# Altium project WaterLevelRF.PrjPcb
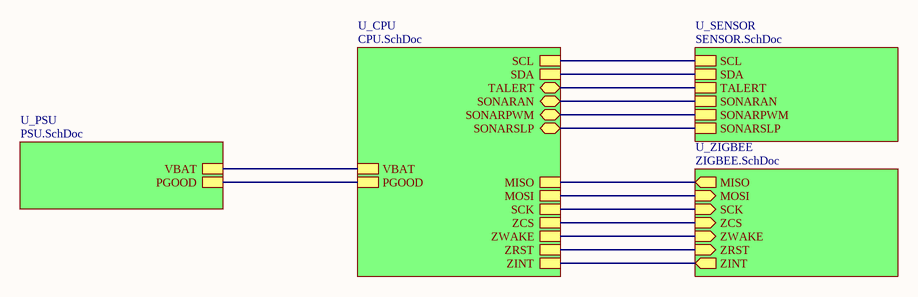
[diagram p0: WaterLevelRF.SchDoc]
7 sheets, 34 parts. Net scope: hierarchical (ports join the sheet entries above them; power ports are global).
Board file: WaterLevelRF.PcbDoc
Sheets:
  WaterLevelRF.SchDoc
    U_SENSOR = SENSOR.SchDoc
      U_TEMP = TEMP.SchDoc
      U_SONAR = SONAR.SchDoc
    U_ZIGBEE = ZIGBEE.SchDoc
    U_CPU = CPU.SchDoc
    U_PSU = PSU.SchDoc

## Sheet WaterLevelRF.SchDoc
size A4

### Sub-sheets
U_CPU = CPU.SchDoc: MOSI, MISO, SCK, ZCS, ZWAKE, ZRST, SCL, SDA, VBAT, ZINT, PGOOD, SONARAN, SONARPWM, SONARSLP, TALERT
U_PSU = PSU.SchDoc: PGOOD, VBAT
U_SENSOR = SENSOR.SchDoc: SCL, SDA, TALERT, SONARAN, SONARPWM, SONARSLP
U_ZIGBEE = ZIGBEE.SchDoc: MISO (out), MOSI (in), SCK (in), ZINT (out), ZCS (in), ZWAKE (in), ZRST (in)

### Nets
MISO: sheet U_ZIGBEE/MISO, sheet U_CPU/MISO
MOSI: sheet U_ZIGBEE/MOSI, sheet U_CPU/MOSI
PGOOD: sheet U_CPU/PGOOD, sheet U_PSU/PGOOD
RNGAN: sheet U_SENSOR/SONARAN, sheet U_CPU/SONARAN
RNGPWM: sheet U_SENSOR/SONARPWM, sheet U_CPU/SONARPWM
RNGSLP: sheet U_SENSOR/SONARSLP, sheet U_CPU/SONARSLP
SCK: sheet U_ZIGBEE/SCK, sheet U_CPU/SCK
SCL: sheet U_SENSOR/SCL, sheet U_CPU/SCL
SDA: sheet U_SENSOR/SDA, sheet U_CPU/SDA
TALERT: sheet U_SENSOR/TALERT, sheet U_CPU/TALERT
VBAT: sheet U_CPU/VBAT, sheet U_PSU/VBAT
ZCS: sheet U_ZIGBEE/ZCS, sheet U_CPU/ZCS
ZINT: sheet U_ZIGBEE/ZINT, sheet U_CPU/ZINT
ZRST: sheet U_ZIGBEE/ZRST, sheet U_CPU/ZRST
ZWAKE: sheet U_ZIGBEE/ZWAKE, sheet U_CPU/ZWAKE

## Sheet SENSOR.SchDoc
size A4
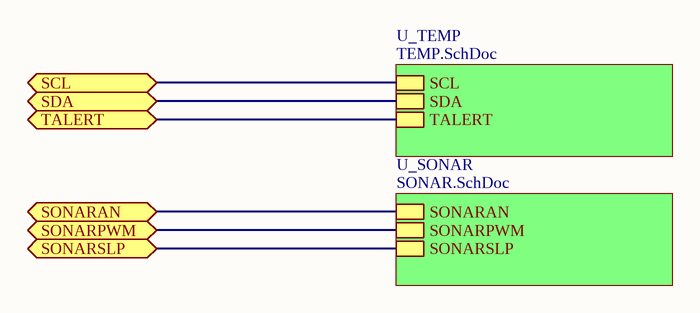
[diagram p1: SENSOR.SchDoc]

### Sub-sheets
U_SONAR = SONAR.SchDoc: SONARAN, SONARPWM, SONARSLP
U_TEMP = TEMP.SchDoc: SCL, SDA, TALERT

### Ports
SCL, SDA, SONARAN, SONARPWM, SONARSLP, TALERT

### Nets
RNGAN: port SONARAN, sheet U_SONAR/SONARAN
RNGPWM: port SONARPWM, sheet U_SONAR/SONARPWM
RNGSLP: port SONARSLP, sheet U_SONAR/SONARSLP
SCL: port SCL, sheet U_TEMP/SCL
SDA: port SDA, sheet U_TEMP/SDA
TALERT: port TALERT, sheet U_TEMP/TALERT

## Sheet TEMP.SchDoc
size A4
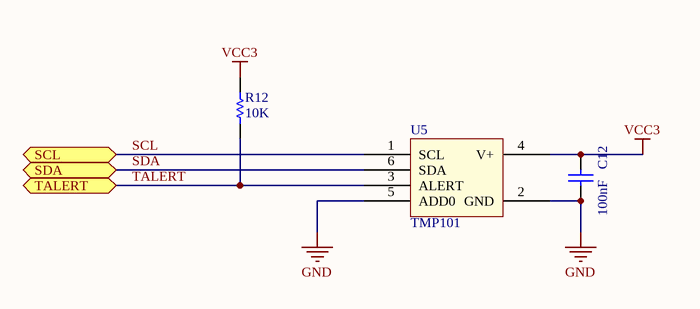
[diagram p2: TEMP.SchDoc]

### Parts
C12  value 100nF  [RESC2012L]  (hidden comment: Cap Semi)
R12  value 10K  [RES0805]  (hidden comment: Res Semi)
U5  TMP101  [SOT23-6_L]

### Ports
SCL, SDA, TALERT

### Nets
GND: C12.1 U5.2(GND) U5.5(ADD0)
VCC3: C12.2 R12.2 U5.4(V+)
SCL: U5.1(SCL) ; port SCL
SDA: U5.6(SDA) ; port SDA
TALERT: R12.1 U5.3(ALERT) ; port TALERT

### Library data of the parts
C12 = Cap Semi: Capacitor (Semiconductor SIM Model); Published: 8-Jun-2000; LatestRevisionDate: 29-May-2009; LatestRevisionNote: IPC-7351 Footprint Added.; PackageReference: C1206; Publisher: Altium Limited; PackageDescription: Chip Capacitor
R12 = Res Semi: Semiconductor Resistor; Published: 8-Jun-2000; LatestRevisionDate: 17-Jul-2002; LatestRevisionNote: Re-released for DXP Platform.; PackageReference: AXIAL-0.5; Publisher: Altium Limited; PackageDescription: Axial Device, Thru-Hole; 2 Leads; 0.5 in Pin Spacing
U5 = TMP101: I2C Temperature Sensor

## Sheet SONAR.SchDoc
size A4
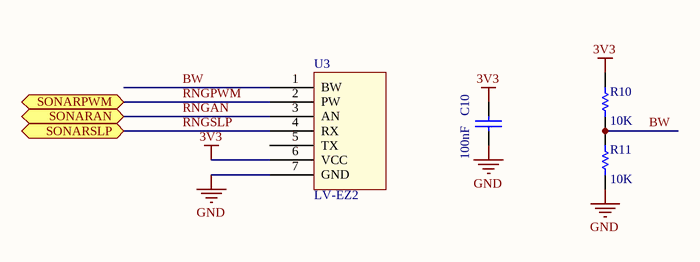
[diagram p3: SONAR.SchDoc]

### Parts
C10  CAP0805-100NF  [RESC2012L]  (value not drawn)
R10  value 10K  [RESC2012L]  (hidden comment: RES0805-10K)
R11  value 10K  [RESC2012L]  (hidden comment: RES0805-10K)
U3  LV-EZ2  [LV-EZ2]

### Ports
SONARAN, SONARPWM, SONARSLP

### Nets
3V3: C10.1 R10.2 U3.6(VCC)
GND: C10.2 R11.1 U3.7(GND)
BW: R10.1 R11.2 U3.1(BW)
RNGAN: U3.3(AN) ; port SONARAN
RNGPWM: U3.2(PW) ; port SONARPWM
RNGSLP: U3.4(RX) ; port SONARSLP

Not connected (* = marked no-connect by the designer): U3 5(TX)

### Notes on the sheet
- (in symbol CAP 0805 100nF) 100nF

### Library data of the parts
C10 = CAP 0805 100nF
R10 R11 = Res Semi: Semiconductor Resistor; Published: 8-Jun-2000; LatestRevisionDate: 17-Jul-2002; LatestRevisionNote: Re-released for DXP Platform.; PackageReference: AXIAL-0.5; Publisher: Altium Limited; PackageDescription: Axial Device, Thru-Hole; 2 Leads; 0.5 in Pin Spacing
U3 = LV-EZ2: Ultrasonic Sensor

## Sheet ZIGBEE.SchDoc
size A4
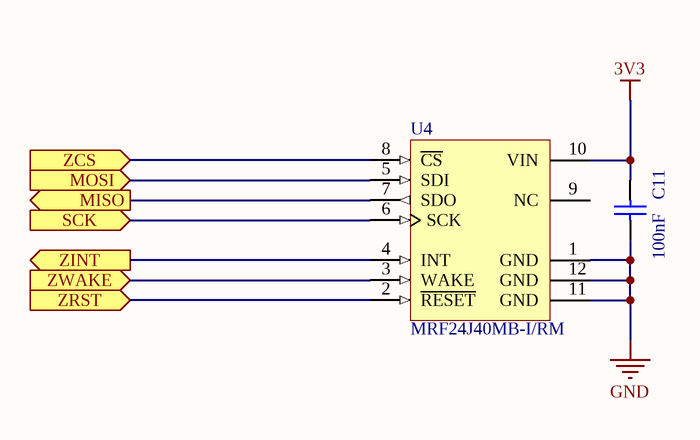
[diagram p4: ZIGBEE.SchDoc]

### Parts
C11  value 100nF  [RESC2012L]  (hidden comment: CAP0603-)
U4  MRF24J40MB-I/RM  [MRF24J40MB]

### Ports
MISO (out), MOSI (in), SCK (in), ZCS (in), ZINT (out), ZRST (in), ZWAKE (in)

### Nets
3V3: C11.2 U4.10(VIN)
GND: C11.1 U4.1(GND) U4.11(GND) U4.12(GND)
MISO: U4.7(SDO) ; port MISO
MOSI: U4.5(SDI) ; port MOSI
SCK: U4.6(SCK) ; port SCK
ZCS: U4.8(~{CS}) ; port ZCS
ZINT: U4.4(INT) ; port ZINT
ZRST: U4.2(~{RESET}) ; port ZRST
ZWAKE: U4.3(WAKE) ; port ZWAKE

Not connected (* = marked no-connect by the designer): U4 9(NC)

### Library data of the parts
C11 = Cap Semi: Capacitor (Semiconductor SIM Model); Published: 8-Jun-2000; LatestRevisionDate: 29-May-2009; LatestRevisionNote: IPC-7351 Footprint Added.; PackageReference: C1206; Publisher: Altium Limited; PackageDescription: Chip Capacitor
U4 = MRF24J40MB-I/RM: 2.4 GHz IEEE Std. 802.15.4, 20 dBm RF Transceiver 12-Pin Module, Industrial Temperature; FirstPublished: 2-Dec-2009; DatasheetVersion: revB, Aug-2009; PackageVersion: Aug-2009; PackageReference: MRF24J40MB; Publisher: Altium Limited; PackageDescription: Transceiver Module; SM; 12 Leads; Body 1.3 x 0.9 x 0.1" (LxWxH), 0.1" Pitch; Supplier 1: Digi-Key; Supplier Part Number 1: MRF24J40MB-I/RM-ND; Supplier 2: Farnell; Supplier Part Number 2: 1755199; Supplier 3: Newark; Supplier Part Number 3: 14R8960; ComponentLink1Description: Datasheet; ComponentLink1URL: http://ww1.microchip.com/downloads/en/DeviceDoc/70599B.pdf; ComponentLink2Description: Packaging Specification; ComponentLink2URL: http://www.microchip.com/stellent/groups/techpub_sg/documents/packagingspec/en012702.pdf; ComponentLink3Description: Microchip.com Home; ComponentLink3URL: http://www.microchip.com/

## Sheet CPU.SchDoc
size A4
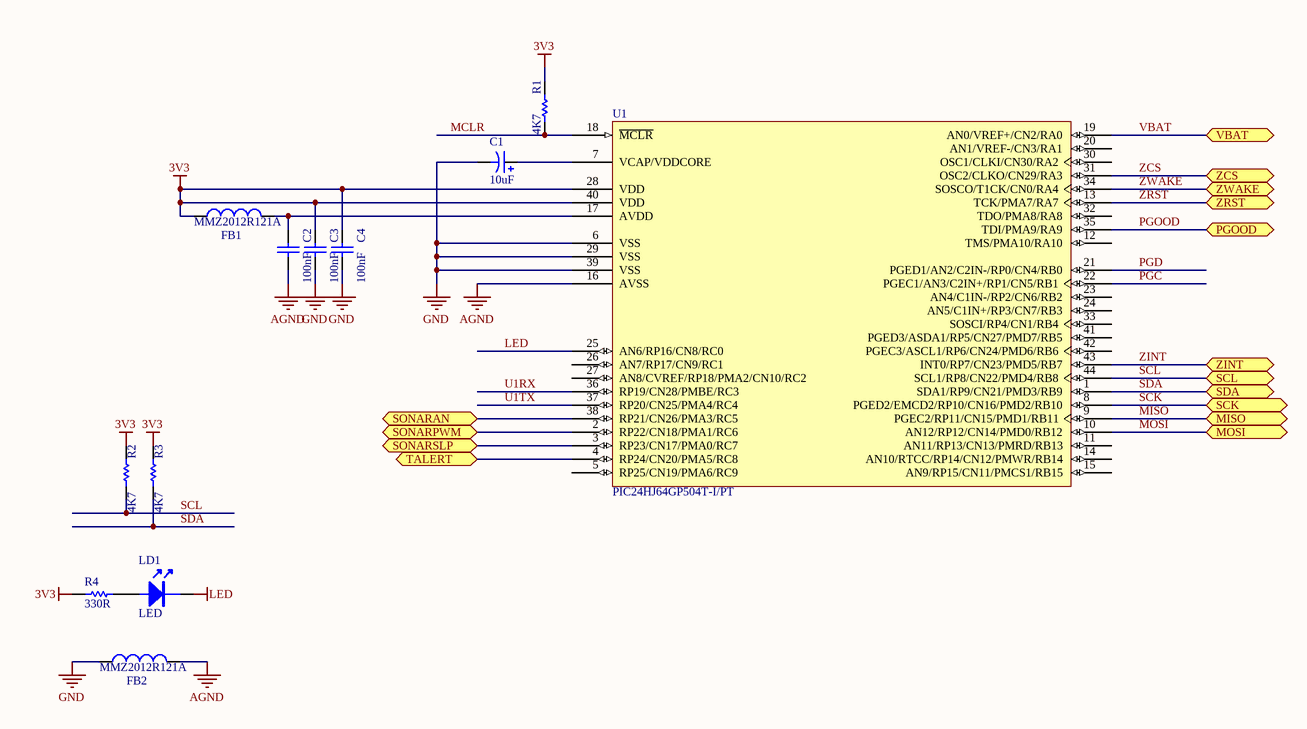
[diagram p5: CPU.SchDoc]

### Parts
C1  value 10uF  [B]  (hidden comment: Cap Pol3)
C2  value 100nF  [RESC2012L]  (hidden comment: CAP0603-)
C3  value 100nF  [RESC2012L]  (hidden comment: CAP0603-)
C4  value 100nF  [RESC2012L]  (hidden comment: CAP0603-)
FB1  MMZ2012R121A  [RESC2012L]
FB2  MMZ2012R121A  [RESC2012L]
LD1  LED  [LED805]
R1  value 4K7  [RESC2012L]  (hidden comment: RES0603-)
R2  value 4K7  [RESC2012L]  (hidden comment: RES0603-)
R3  value 4K7  [RESC2012L]  (hidden comment: RES0603-)
R4  value 330R  [RESC2012L]  (hidden comment: RES0603-)
U1  PIC24HJ64GP504T-I/PT  [TQFP-PT44_M]

### Ports
MISO, MOSI, PGOOD, SCK, SCL, SDA, SONARAN, SONARPWM, SONARSLP, TALERT, VBAT, ZCS, ZINT, ZRST, ZWAKE

### Nets
3V3: C3.2 C4.2 FB1.1 R1.2 R2.2 R3.2 R4.2 U1.28(VDD) U1.40(VDD)
AGND: C2.1 FB2.2 U1.16(AVSS)
GND: C1.2 C3.1 C4.1 FB2.1 U1.6(VSS) U1.29(VSS) U1.39(VSS)
LED: LD1.K U1.25(AN6/RP16/CN8/RC0)
MCLR: R1.1 U1.18(~{MCLR})
MISO: U1.9(PGEC2/RP11/CN15/PMD1/RB11) ; port MISO
MOSI: U1.10(AN12/RP12/CN14/PMD0/RB12) ; port MOSI
PGC: U1.22(PGEC1/AN3/C2IN+/RP1/CN5/RB1)
PGD: U1.21(PGED1/AN2/C2IN-/RP0/CN4/RB0)
PGOOD: U1.35(TDI/PMA9/RA9) ; port PGOOD
RNGAN: U1.38(RP21/CN26/PMA3/RC5) ; port SONARAN
RNGPWM: U1.2(RP22/CN18/PMA1/RC6) ; port SONARPWM
RNGSLP: U1.3(RP23/CN17/PMA0/RC7) ; port SONARSLP
SCK: U1.8(PGED2/EMCD2/RP10/CN16/PMD2/RB10) ; port SCK
SCL: R2.1 U1.44(SCL1/RP8/CN22/PMD4/RB8) ; port SCL
SDA: R3.1 U1.1(SDA1/RP9/CN21/PMD3/RB9) ; port SDA
TALERT: U1.4(RP24/CN20/PMA5/RC8) ; port TALERT
U1RX: U1.36(RP19/CN28/PMBE/RC3)
U1TX: U1.37(RP20/CN25/PMA4/RC4)
VBAT: U1.19(AN0/VREF+/CN2/RA0) ; port VBAT
ZCS: U1.31(OSC2/CLKO/CN29/RA3) ; port ZCS
ZINT: U1.43(INT0/RP7/CN23/PMD5/RB7) ; port ZINT
ZRST: U1.13(TCK/PMA7/RA7) ; port ZRST
ZWAKE: U1.34(SOSCO/T1CK/CN0/RA4) ; port ZWAKE
NetC1_1: C1.1 U1.7(VCAP/VDDCORE)
NetC2_2: C2.2 FB1.2 U1.17(AVDD)
NetLD1_A: LD1.A R4.1

Not connected (* = marked no-connect by the designer): U1 5(RP25/CN19/PMA6/RC9) 11(AN11/RP13/CN13/PMRD/RB13) 12(TMS/PMA10/RA10) 14(AN10/RTCC/RP14/CN12/PMWR/RB14) 15(AN9/RP15/CN11/PMCS1/RB15) 20(AN1/VREF-/CN3/RA1) 23(AN4/C1IN-/RP2/CN6/RB2) 24(AN5/C1IN+/RP3/CN7/RB3) 26(AN7/RP17/CN9/RC1) 27(AN8/CVREF/RP18/PMA2/CN10/RC2) 30(OSC1/CLKI/CN30/RA2) 32(TDO/PMA8/RA8) 33(SOSCI/RP4/CN1/RB4) 41(PGED3/ASDA1/RP5/CN27/PMD7/RB5) 42(PGEC3/ASCL1/RP6/CN24/PMD6/RB6)

### Library data of the parts
C1 = Cap Pol3: Polarized Capacitor (Surface Mount); Published: 8-Jun-2000; LatestRevisionDate: 29-May-2009; LatestRevisionNote: IPC-7351 Footprint Added.; PackageReference: C0805; Publisher: Altium Limited; PackageDescription: Chip Capacitor
C2-C4 = Cap Semi: Capacitor (Semiconductor SIM Model); Published: 8-Jun-2000; LatestRevisionDate: 29-May-2009; LatestRevisionNote: IPC-7351 Footprint Added.; PackageReference: C1206; Publisher: Altium Limited; PackageDescription: Chip Capacitor
FB1 FB2 = Inductor: Code_IEC: 1005; Published: 8-Jun-2000; LatestRevisionDate: 29-May-2009; LatestRevisionNote: IPC-7351 Footprint Added.; PackageReference: 0402-A; Publisher: Altium Limited; PackageDescription: Chip Inductor; Code_JEITA: 0402
R1-R4 = Res Semi: Semiconductor Resistor; Published: 8-Jun-2000; LatestRevisionDate: 17-Jul-2002; LatestRevisionNote: Re-released for DXP Platform.; PackageReference: AXIAL-0.5; Publisher: Altium Limited
U1 = PIC24HJ64GP504T-I/PT: High Speed General Purpose 16-Bit Flash Microcontroller, 64KB Flash, 8KB RAM, 44-Pin TQFP, Industrial Temperature, Tape and Reel; FirstPublished: 2-Dec-2009; DatasheetVersion: revD, Nov-2009; PackageVersion: revBB, Aug-2009; PackageReference: TQFP-PT44; Publisher: Altium Limited; PackageDescription: 44-Lead Plastic Thin Quad Flatpack (PT) - 10x10x1mm Body, 2.00mm [TQFP]; Supplier 1: Digi-Key; Supplier Part Number 1: PIC24HJ64GP504T-I/PTTR-ND; Supplier 2: Newark; Supplier Part Number 2: 40M1549; Code_JEDEC: MS-026; ComponentLink1Description: Datasheet; ComponentLink1URL: http://ww1.microchip.com/downloads/en/DeviceDoc/70293D.pdf; ComponentLink2Description: Packaging Specification; ComponentLink2URL: http://www.microchip.com/stellent/groups/techpub_sg/documents/packagingspec/en012702.pdf; ComponentLink3Description: Microchip.com Home; ComponentLink3URL: http://www.microchip.com/

## Sheet PSU.SchDoc
size A4
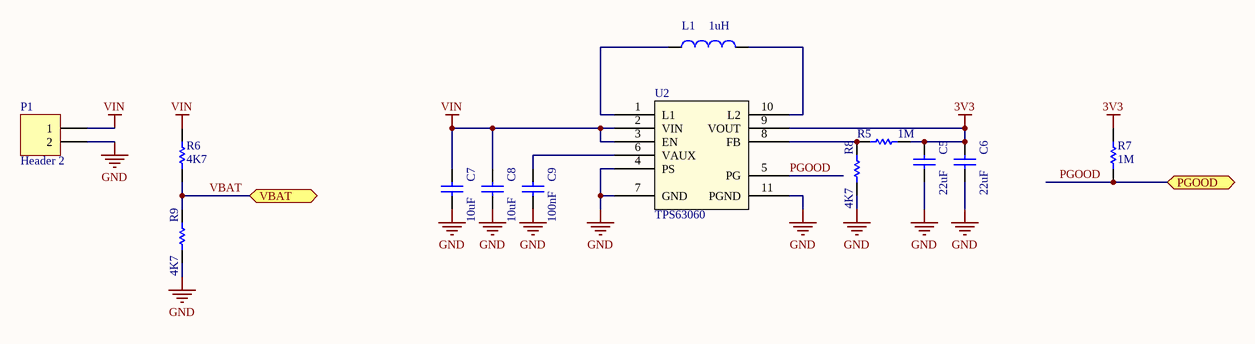
[diagram p6: PSU.SchDoc]

### Parts
C5  value 22uF  [CAPC2512L]  (hidden comment: CAP0603-)
C6  value 22uF  [CAPC2512L]  (hidden comment: CAP0603-)
C7  value 10uF  [CAPC2512L]  (hidden comment: CAP0603-)
C8  value 10uF  [CAPC2512L]  (hidden comment: CAP0603-)
C9  value 100nF  [RESC2012L]  (hidden comment: CAP0603-)
L1  value 1uH  [INDC3225M]  (hidden comment: ?)
P1  Header 2  [HDR1X2]
R5  value 1M  [RESC2012L]  (hidden comment: RES0603-)
R6  value 4K7  [RESC2012L]  (hidden comment: RES0603-)
R7  value 1M  [RESC2012L]  (hidden comment: RES0603-)
R8  value 4K7  [RESC2012L]  (hidden comment: RES0603-)
R9  value 4K7  [RESC2012L]  (hidden comment: RES0603-)
U2  TPS63060  [SON50P300X300X100-11V]

### Ports
PGOOD, VBAT

### Nets
3V3: C5.2 C6.2 R5.1 R7.1 U2.9(VOUT)
GND: C5.1 C6.1 C7.1 C8.1 C9.1 P1.2 R8.1 R9.1 U2.4(PS) U2.7(GND) U2.11(PGND)
VIN: C7.2 C8.2 P1.1 R6.1 U2.2(VIN) U2.3(EN)
PGOOD: R7.2 U2.5(PG) ; port PGOOD
VBAT: R6.2 R9.2 ; port VBAT
NetC9_2: C9.2 U2.6(VAUX)
NetL1_1: L1.1 U2.1(L1)
NetL1_2: L1.2 U2.10(L2)
NetR5_2: R5.2 R8.2 U2.8(FB)

### Library data of the parts
C5-C9 = Cap Semi: Capacitor (Semiconductor SIM Model); Published: 8-Jun-2000; LatestRevisionDate: 29-May-2009; LatestRevisionNote: IPC-7351 Footprint Added.; PackageReference: C1206; Publisher: Altium Limited; PackageDescription: Chip Capacitor
L1 = Inductor: Code_IEC: 1005; Published: 8-Jun-2000; LatestRevisionDate: 29-May-2009; LatestRevisionNote: IPC-7351 Footprint Added.; PackageReference: 0402-A; Publisher: Altium Limited; PackageDescription: Chip Inductor; Code_JEITA: 0402
P1 = Header 2: Header, 2-Pin; LatestRevisionDate: 17-Jul-2002; LatestRevisionNote: Re-released for DXP Platform.; Publisher: Altium Limited
R5-R9 = Res Semi: Semiconductor Resistor; Published: 8-Jun-2000; LatestRevisionDate: 17-Jul-2002; LatestRevisionNote: Re-released for DXP Platform.; PackageReference: AXIAL-0.5; Publisher: Altium Limited
U2 = TPS63060: Buck-Boost Regulator

## Nets that join several sheets
3V3: SONAR (C10.1 R10.2 U3.6), ZIGBEE (C11.2 U4.10), CPU (9 pins), PSU (5 pins)
GND: TEMP (C12.1 U5.2 U5.5), SONAR (C10.2 R11.1 U3.7), ZIGBEE (C11.1 U4.1 U4.11 U4.12), CPU (7 pins), PSU (11 pins)
MISO: ZIGBEE (U4.7), CPU (U1.9)
MOSI: ZIGBEE (U4.5), CPU (U1.10)
PGOOD: CPU (U1.35), PSU (R7.2 U2.5)
RNGAN: SONAR (U3.3), CPU (U1.38)
RNGPWM: SONAR (U3.2), CPU (U1.2)
RNGSLP: SONAR (U3.4), CPU (U1.3)
SCK: ZIGBEE (U4.6), CPU (U1.8)
SCL: TEMP (U5.1), CPU (R2.1 U1.44)
SDA: TEMP (U5.6), CPU (R3.1 U1.1)
TALERT: TEMP (R12.1 U5.3), CPU (U1.4)
VBAT: CPU (U1.19), PSU (R6.2 R9.2)
ZCS: ZIGBEE (U4.8), CPU (U1.31)
ZINT: ZIGBEE (U4.4), CPU (U1.43)
ZRST: ZIGBEE (U4.2), CPU (U1.13)
ZWAKE: ZIGBEE (U4.3), CPU (U1.34)